# Altium schematic sheet Peripherals.SchDoc: uSD, Wifi, LEDs and Push Button
size A4; Date: 29-OCT-2015; Author: A.B; CompanyName: STMicroelectronics; Organization: MCD/TOOLS/GNB; Address1: 12, Rue Jules HOROWITZ; Address2: 38019 Grenoble; Address3: FRANCE; DocumentNumber: MB1225; Revision: B-01; SheetNumber: 12; SheetTotal: 12; Project: STM32F769I-DISCO
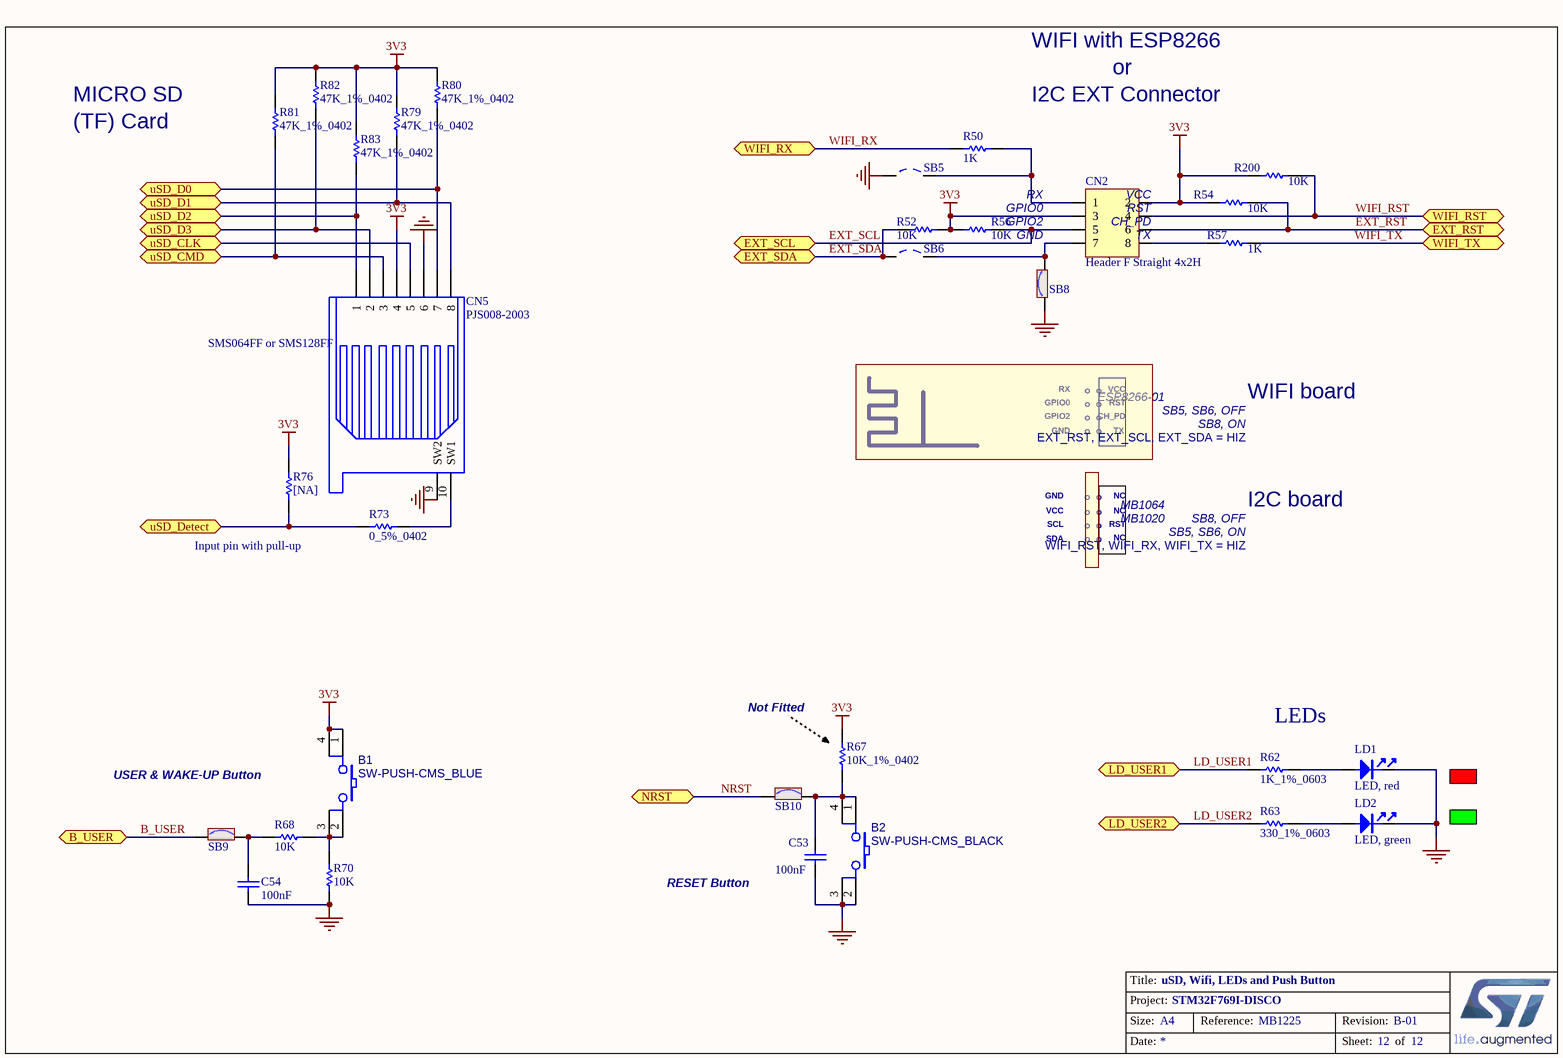
[diagram p0: Peripherals.SchDoc]

## Parts
B1  SW-PUSH-CMS_BLUE  [PB10]
B2  SW-PUSH-CMS_BLACK  [PB10]
C53  100nF  [0402C]
C54  100nF  [0402C]
CN2  Header F Straight 4x2H  [HDR_2X4_2R54]
CN5  PJS008-2003  [MSD_PJS008_]
LD1  LED, red  [0603D]
LD2  LED, green  [0603D]
R50  1K  [0402R]
R52  10K  [0402R]
R54  10K  [0402R]
R56  10K  [0402R]
R57  1K  [0402R]
R62  1K_1%_0603  [0603R]
R63  330_1%_0603  [0603R]
R67  10K_1%_0402  [0402R]
R68  10K  [0402R]
R70  10K  [0402R]
R73  0_5%_0402  [0402R]
R76  [NA]  [0402R]
R79  47K_1%_0402  [0402R]
R80  47K_1%_0402  [0402R]
R81  47K_1%_0402  [0402R]
R82  47K_1%_0402  [0402R]
R83  47K_1%_0402  [0402R]
R200  10K  [0402R]
SB5  Solder Bridge OFF  [JP2_SMD]  (value not drawn)
SB6  Solder Bridge OFF  [JP2_SMD]  (value not drawn)
SB8  Solder Bridge ON  [JP2_SMD]  (value not drawn)
SB9  Solder Bridge ON  [JP2_SMD]  (value not drawn)
SB10  Solder Bridge ON  [JP2_SMD]  (value not drawn)

## Ports
B_USER, EXT_RST, EXT_SCL, EXT_SDA, LD_USER1, LD_USER2, NRST, uSD_CLK, uSD_CMD, uSD_D0, uSD_D1, uSD_D2, uSD_D3, uSD_Detect, WIFI_RST, WIFI_RX, WIFI_TX

## Nets
3V3: B1.1 B1.4 CN2.2 CN2.3 CN5.4 R52.2 R54.1 R56.1 R67.2 R76.2 R79.2 R80.2 R81.2 R82.2 R83.2 R200.1
GND: B2.2 B2.3 C53.1 C54.1 CN5.6 CN5.9(SW2) LD1.2 LD2.2 R70.1 SB5.1 SB8.1
B_USER: SB9.1 ; port B_USER
EXT_RST: CN2.6 R54.2 ; port EXT_RST
EXT_SCL: CN2.5 R56.2 ; port EXT_SCL
EXT_SDA: R52.1 SB6.1 ; port EXT_SDA
LD_USER1: R62.1 ; port LD_USER1
LD_USER2: R63.1 ; port LD_USER2
NRST: SB10.1 ; port NRST
uSD_CLK: CN5.5 ; port uSD_CLK
uSD_CMD: CN5.3 R81.1 ; port uSD_CMD
uSD_D0: CN5.7 R80.1 ; port uSD_D0
uSD_D1: CN5.8 R79.1 ; port uSD_D1
uSD_D2: CN5.1 R83.1 ; port uSD_D2
uSD_D3: CN5.2 R82.1 ; port uSD_D3
uSD_Detect: R73.1 R76.1 ; port uSD_Detect
WIFI_RST: CN2.4 R200.2 ; port WIFI_RST
WIFI_RX: R50.1 ; port WIFI_RX
WIFI_TX: R57.2 ; port WIFI_TX
NetB1_2: B1.2 B1.3 R68.2 R70.2
NetB2_1: B2.1 B2.4 C53.2 R67.1 SB10.2
NetC54_2: C54.2 R68.1 SB9.2
NetCN2_1: CN2.1 R50.2 SB5.2
NetCN2_7: CN2.7 SB6.2 SB8.2
NetCN2_8: CN2.8 R57.1
NetCN5_10: CN5.10(SW1) R73.2
NetLD1_1: LD1.1 R62.2
NetLD2_1: LD2.1 R63.2

## Notes on the sheet
- WIFI with ESP8266
- MICRO SD
- (TF) Card
- I2C EXT Connector
- or
- (near CN2) RX
- (near CN2) VCC
- GND
- (near CN2) GPIO2
- (near CN2) GPIO0
- (near CN2) CH_PD
- (near CN2) RST
- (near CN2) TX
- (near CN5) SMS064FF or SMS128FF
- GPIO0
- RX
- ° °
- VCC
- RST
- ESP8266-01
- WIFI board
- GPIO2
- TX
- CH_PD
- SB5, SB6, OFF
- SB8, ON
- EXT_RST, EXT_SCL, EXT_SDA = HIZ
- SCL
- SDA
- NC
- MB1064
- MB1020
- I2C board
- SB8, OFF
- SB5, SB6, ON
- Input pin with pull-up
- WIFI_RST, WIFI_RX, WIFI_TX = HIZ
- (near R67) Not Fitted
- LEDs
- USER & WAKE-UP Button
- RESET Button
- Title:
- Project:
- Size:
- Date:
- A4
- Reference:
- Sheet:
- Revision:
- of

## Library data of the parts
B1 = SW-PUSH-CMS_BLUE: Non-Open Push-Button 0.1A 24V; Manuf_2: FARNELL; Manuf_Part_2: 535-930; Manuf_1: wealthmetal; Manuf_Part_1: TD0341X-G01-BLU; Ref St: 9180120; Description: Non-Open Push Button,Blue 0.1A 24V,Square head,6*6,SMT,180Degree,TD-0341X-GO1,wealthmetal; SMEE_FP: BP1CMS; Provided: Sub Co; Distrib: Sub Co; ECCN_US/EU: n/a; SOFER_FP: PB10
B2 = SW-PUSH-CMS_BLACK: Non-Open Push-Button 0.1A 24V; Manuf_2: FARNELL; Manuf_Part_2: 535-930; Manuf_1: wealthmetal; Manuf_Part_1: TD0341X-G01-BLA; Ref St: 9180120; Description: Non-Open Push Button,Black 0.1A 24V,Square head,6*6,SMT,180Degree,TD-0341X-GO1,wealthmetal; SMEE_FP: BP1CMS; SOFER_FP: BP10; Provided: Sub Co; Distrib: Sub Co; ECCN_US/EU: n/a
C53 C54 = Cap_100nF_X7R_10%_0402: Capacitor,100nF,16V,X7R,10%,0402,YAGEO; Manuf_Part_1: CC0402KRX7R7BB104; Revision: July-2002: Re-released for DXP Platform.; Value: 100nF; Order: CC0402KRX7R7BB104; Manuf_1: YAGEO
CN2 = Header 4X2F: Header Female, 4-Pin, Dual row, Straight; Manuf_Part_1: BL 2-8G; Manuf_1: Fischer Electronik; Distrib: Sub Co; Footprint: HDR2X4H; ECCN_US/EU: n/a
CN5 = microSD-PJS008-2003: Memory Card Connectors MicroSD Card Conn Revrs Mnt Push-Push; Manuf_Part_1: PJS008-2003-1; Manuf_1: YAMAICHI; Distrib: Sub Co; Order: PJS008-2003-1; ECCN_US/EU: n/a
LD1 = LED_red: LED, red, 0603; Manuf_1: everlight; Manuf_Part_1: 19-213-R6C-AP1Q2B/3T; Description: LED,red,0603,19-213-R6C-AP1Q2B/3T,everlight; ECCN_US/EU: EAR99/NEC; Order: 19-213-R6C-AP1Q2B/3T
LD2 = LED_green: LED, green, 0603; Manuf_1: everlight; Manuf_Part_1: 19-213SYGC/S530-E2/TR8; Description: LED,green,0603,19-213SYGC/S530-E2/TR8,everlight; ECCN_US/EU: EAR99/NEC; Order: 19-213SYGC/S530-E2/TR8
R50 R57 = Res_1K_1%_0402: Resistor,1K,0402,1%,YAGEO; Manuf_Part_1: RC0402FR-071KL; Value: 1K; Manuf_1: YAGEO; Order: RC0402FR-071KL; ECCN_US/EU: n/a
R52 R54 R56 R68 R70 R200 = Res_10K_1%_0402: Resistor,10K,0402,1%,YAGEO; Manuf_Part_1: RC0402FR-0710KL; Value: 10K; Manuf_1: YAGEO; Order: RC0402FR-0710KL; ECCN_US/EU: n/a
R62 = Res_1K_1%_0603: Resistor,1K,0603,1%,YAGEO; Manuf_Part_1: RC0603FR-071KL; Value: 1K; Manuf_1: YAGEO; Order: RC0603FR-071KL; ECCN_US/EU: n/a
R63 = Res_330_1%_0603: Resistor,330,0603,1%,YAGEO; Manuf_Part_1: RC0603FR-07330RL; Manuf_Part_2: RT0603FRE07330RL; Value: 330; ECCN_US/EU: n/a; Manuf_1: YAGEO; Distrib: FARNELL; Manuf_2: YAGEO
R67 = Res_10K_1%_0402: Resistor,10K,0402,1%,YAGEO; Manuf_Part_1: RC0402FR-0710KL; Fitted: NO; Value: 10K; Manuf_1: YAGEO; Order: RC0402FR-0710KL; ECCN_US/EU: n/a
R73 = Res_0_5%_0402: Resistor,0,0402,5%,YAGEO; Manuf_Part_1: RC0402JR-070RL; Value: 0; Order: 2363467; ECCN_US/EU: n/a; Manuf_1: YAGEO; Distrib: FARNELL
R76 = Res_NA_0402: Resistor,[NA],0402; Fitted: NO; Value: [NA]; ECCN_US/EU: n/a
R79-R83 = Res_47K_1%_0402: Resistor,47K,0402,1%,YAGEO; Manuf_Part_1: RC0402FR-0747KL; Order: 9239430; Value: 47K; Manuf_1: YAGEO; ECCN_US/EU: n/a; Distrib: FARNELL
SB5 SB6 = SB_OFF: Solder: NO; Revision: July-2002: Re-released for DXP Platform.; ECCN_US/EU: n/a
SB8-SB10 = SB_ON: Solder: YES; Revision: July-2002: Re-released for DXP Platform.; ECCN_US/EU: n/a